# EAGLE design SN74ALVC164245 Level Shifter (EAGLE 9.5.2)
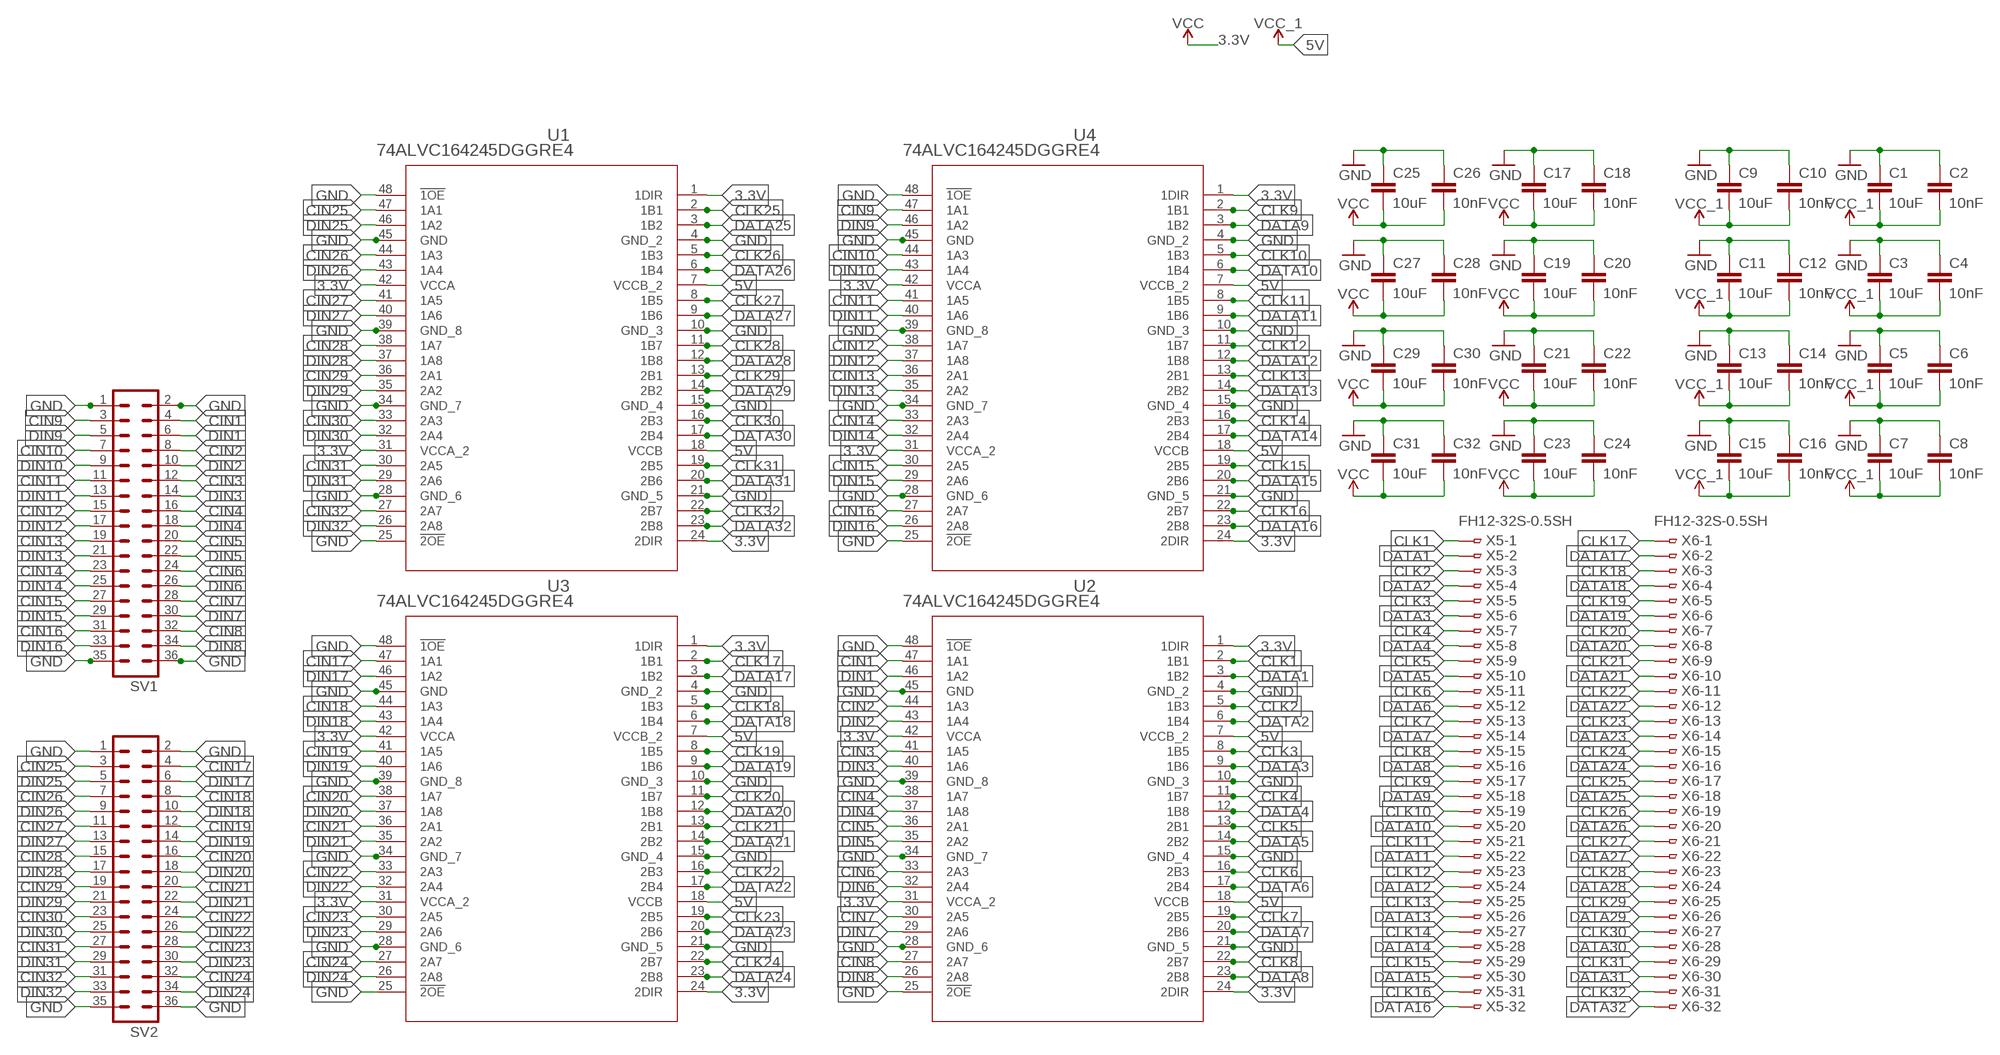
[diagram p0: schematic, sheet 1]

## Parts
C1  10uF  10UF-0402T-6.3V-20%  [0402-TIGHT]
C2  10nF  10NF-0402T-25V-10%  [0402-TIGHT]
C3  10uF  10UF-0402T-6.3V-20%  [0402-TIGHT]
C4  10nF  10NF-0402T-25V-10%  [0402-TIGHT]
C5  10uF  10UF-0402T-6.3V-20%  [0402-TIGHT]
C6  10nF  10NF-0402T-25V-10%  [0402-TIGHT]
C7  10uF  10UF-0402T-6.3V-20%  [0402-TIGHT]
C8  10nF  10NF-0402T-25V-10%  [0402-TIGHT]
C9  10uF  10UF-0402T-6.3V-20%  [0402-TIGHT]
C10  10nF  10NF-0402T-25V-10%  [0402-TIGHT]
C11  10uF  10UF-0402T-6.3V-20%  [0402-TIGHT]
C12  10nF  10NF-0402T-25V-10%  [0402-TIGHT]
C13  10uF  10UF-0402T-6.3V-20%  [0402-TIGHT]
C14  10nF  10NF-0402T-25V-10%  [0402-TIGHT]
C15  10uF  10UF-0402T-6.3V-20%  [0402-TIGHT]
C16  10nF  10NF-0402T-25V-10%  [0402-TIGHT]
C17  10uF  10UF-0402T-6.3V-20%  [0402-TIGHT]
C18  10nF  10NF-0402T-25V-10%  [0402-TIGHT]
C19  10uF  10UF-0402T-6.3V-20%  [0402-TIGHT]
C20  10nF  10NF-0402T-25V-10%  [0402-TIGHT]
C21  10uF  10UF-0402T-6.3V-20%  [0402-TIGHT]
C22  10nF  10NF-0402T-25V-10%  [0402-TIGHT]
C23  10uF  10UF-0402T-6.3V-20%  [0402-TIGHT]
C24  10nF  10NF-0402T-25V-10%  [0402-TIGHT]
C25  10uF  10UF-0402T-6.3V-20%  [0402-TIGHT]
C26  10nF  10NF-0402T-25V-10%  [0402-TIGHT]
C27  10uF  10UF-0402T-6.3V-20%  [0402-TIGHT]
C28  10nF  10NF-0402T-25V-10%  [0402-TIGHT]
C29  10uF  10UF-0402T-6.3V-20%  [0402-TIGHT]
C30  10nF  10NF-0402T-25V-10%  [0402-TIGHT]
C31  10uF  10UF-0402T-6.3V-20%  [0402-TIGHT]
C32  10nF  10NF-0402T-25V-10%  [0402-TIGHT]
SV1  MA18-2  [MA18-2]
SV2  MA18-2  [MA18-2]
U1  74ALVC164245DGGRE4  [DGG48]
U2  74ALVC164245DGGRE4  [DGG48]
U3  74ALVC164245DGGRE4  [DGG48]
U4  74ALVC164245DGGRE4  [DGG48]
X5  FH12-32S-0.5SH  [FH12-32S-0.5SH]
X6  FH12-32S-0.5SH  [FH12-32S-0.5SH]

## Nets
3.3V: C17.2 C18.2 C19.2 C20.2 C21.2 C22.2 C23.2 C24.2 C25.2 C26.2 C27.2 C28.2 C29.2 C30.2 C31.2 C32.2 U1.1(1DIR) U1.24(2DIR) U1.31(VCCA_2) U1.42(VCCA) U2.1(1DIR) U2.24(2DIR) U2.31(VCCA_2) U2.42(VCCA) U3.1(1DIR) U3.24(2DIR) U3.31(VCCA_2) U3.42(VCCA) U4.1(1DIR) U4.24(2DIR) U4.31(VCCA_2) U4.42(VCCA) ; supply symbol labelled VCC
5V: C1.2 C2.2 C3.2 C4.2 C5.2 C6.2 C7.2 C8.2 C9.2 C10.2 C11.2 C12.2 C13.2 C14.2 C15.2 C16.2 U1.7(VCCB_2) U1.18(VCCB) U2.7(VCCB_2) U2.18(VCCB) U3.7(VCCB_2) U3.18(VCCB) U4.7(VCCB_2) U4.18(VCCB) ; supply symbol labelled VCC_1
CIN1: SV1.4 U2.47(1A1)
CIN2: SV1.8 U2.44(1A3)
CIN3: SV1.12 U2.41(1A5)
CIN4: SV1.16 U2.38(1A7)
CIN5: SV1.20 U2.36(2A1)
CIN6: SV1.24 U2.33(2A3)
CIN7: SV1.28 U2.30(2A5)
CIN8: SV1.32 U2.27(2A7)
CIN9: SV1.3 U4.47(1A1)
CIN10: SV1.7 U4.44(1A3)
CIN11: SV1.11 U4.41(1A5)
CIN12: SV1.15 U4.38(1A7)
CIN13: SV1.19 U4.36(2A1)
CIN14: SV1.23 U4.33(2A3)
CIN15: SV1.27 U4.30(2A5)
CIN16: SV1.31 U4.27(2A7)
CIN17: SV2.4 U3.47(1A1)
CIN18: SV2.8 U3.44(1A3)
CIN19: SV2.12 U3.41(1A5)
CIN20: SV2.16 U3.38(1A7)
CIN21: SV2.20 U3.36(2A1)
CIN22: SV2.24 U3.33(2A3)
CIN23: SV2.28 U3.30(2A5)
CIN24: SV2.32 U3.27(2A7)
CIN25: SV2.3 U1.47(1A1)
CIN26: SV2.7 U1.44(1A3)
CIN27: SV2.11 U1.41(1A5)
CIN28: SV2.15 U1.38(1A7)
CIN29: SV2.19 U1.36(2A1)
CIN30: SV2.23 U1.33(2A3)
CIN31: SV2.27 U1.30(2A5)
CIN32: SV2.31 U1.27(2A7)
CLK1: U2.2(1B1) X5.1
CLK2: U2.5(1B3) X5.3
CLK3: U2.8(1B5) X5.5
CLK4: U2.11(1B7) X5.7
CLK5: U2.13(2B1) X5.9
CLK6: U2.16(2B3) X5.11
CLK7: U2.19(2B5) X5.13
CLK8: U2.22(2B7) X5.15
CLK9: U4.2(1B1) X5.17
CLK10: U4.5(1B3) X5.19
CLK11: U4.8(1B5) X5.21
CLK12: U4.11(1B7) X5.23
CLK13: U4.13(2B1) X5.25
CLK14: U4.16(2B3) X5.27
CLK15: U4.19(2B5) X5.29
CLK16: U4.22(2B7) X5.31
CLK17: U3.2(1B1) X6.1
CLK18: U3.5(1B3) X6.3
CLK19: U3.8(1B5) X6.5
CLK20: U3.11(1B7) X6.7
CLK21: U3.13(2B1) X6.9
CLK22: U3.16(2B3) X6.11
CLK23: U3.19(2B5) X6.13
CLK24: U3.22(2B7) X6.15
CLK25: U1.2(1B1) X6.17
CLK26: U1.5(1B3) X6.19
CLK27: U1.8(1B5) X6.21
CLK28: U1.11(1B7) X6.23
CLK29: U1.13(2B1) X6.25
CLK30: U1.16(2B3) X6.27
CLK31: U1.19(2B5) X6.29
CLK32: U1.22(2B7) X6.31
DATA1: U2.3(1B2) X5.2
DATA2: U2.6(1B4) X5.4
DATA3: U2.9(1B6) X5.6
DATA4: U2.12(1B8) X5.8
DATA5: U2.14(2B2) X5.10
DATA6: U2.17(2B4) X5.12
DATA7: U2.20(2B6) X5.14
DATA8: U2.23(2B8) X5.16
DATA9: U4.3(1B2) X5.18
DATA10: U4.6(1B4) X5.20
DATA11: U4.9(1B6) X5.22
DATA12: U4.12(1B8) X5.24
DATA13: U4.14(2B2) X5.26
DATA14: U4.17(2B4) X5.28
DATA15: U4.20(2B6) X5.30
DATA16: U4.23(2B8) X5.32
DATA17: U3.3(1B2) X6.2
DATA18: U3.6(1B4) X6.4
DATA19: U3.9(1B6) X6.6
DATA20: U3.12(1B8) X6.8
DATA21: U3.14(2B2) X6.10
DATA22: U3.17(2B4) X6.12
DATA23: U3.20(2B6) X6.14
DATA24: U3.23(2B8) X6.16
DATA25: U1.3(1B2) X6.18
DATA26: U1.6(1B4) X6.20
DATA27: U1.9(1B6) X6.22
DATA28: U1.12(1B8) X6.24
DATA29: U1.14(2B2) X6.26
DATA30: U1.17(2B4) X6.28
DATA31: U1.20(2B6) X6.30
DATA32: U1.23(2B8) X6.32
DIN1: SV1.6 U2.46(1A2)
DIN2: SV1.10 U2.43(1A4)
DIN3: SV1.14 U2.40(1A6)
DIN4: SV1.18 U2.37(1A8)
DIN5: SV1.22 U2.35(2A2)
DIN6: SV1.26 U2.32(2A4)
DIN7: SV1.30 U2.29(2A6)
DIN8: SV1.34 U2.26(2A8)
DIN9: SV1.5 U4.46(1A2)
DIN10: SV1.9 U4.43(1A4)
DIN11: SV1.13 U4.40(1A6)
DIN12: SV1.17 U4.37(1A8)
DIN13: SV1.21 U4.35(2A2)
DIN14: SV1.25 U4.32(2A4)
DIN15: SV1.29 U4.29(2A6)
DIN16: SV1.33 U4.26(2A8)
DIN17: SV2.6 U3.46(1A2)
DIN18: SV2.10 U3.43(1A4)
DIN19: SV2.14 U3.40(1A6)
DIN20: SV2.18 U3.37(1A8)
DIN21: SV2.22 U3.35(2A2)
DIN22: SV2.26 U3.32(2A4)
DIN23: SV2.30 U3.29(2A6)
DIN24: SV2.34 U3.26(2A8)
DIN25: SV2.5 U1.46(1A2)
DIN26: SV2.9 U1.43(1A4)
DIN27: SV2.13 U1.40(1A6)
DIN28: SV2.17 U1.37(1A8)
DIN29: SV2.21 U1.35(2A2)
DIN30: SV2.25 U1.32(2A4)
DIN31: SV2.29 U1.29(2A6)
DIN32: SV2.33 U1.26(2A8)
GND: C1.1 C2.1 C3.1 C4.1 C5.1 C6.1 C7.1 C8.1 C9.1 C10.1 C11.1 C12.1 C13.1 C14.1 C15.1 C16.1 C17.1 C18.1 C19.1 C20.1 C21.1 C22.1 C23.1 C24.1 C25.1 C26.1 C27.1 C28.1 C29.1 C30.1 C31.1 C32.1 SV1.1 SV1.2 SV1.35 SV1.36 SV2.1 SV2.2 SV2.35 SV2.36 U1.4(GND_2) U1.10(GND_3) U1.15(GND_4) U1.21(GND_5) U1.25(!2OE) U1.28(GND_6) U1.34(GND_7) U1.39(GND_8) U1.45(GND) U1.48(!1OE) U2.4(GND_2) U2.10(GND_3) U2.15(GND_4) U2.21(GND_5) U2.25(!2OE) U2.28(GND_6) U2.34(GND_7) U2.39(GND_8) U2.45(GND) U2.48(!1OE) U3.4(GND_2) U3.10(GND_3) U3.15(GND_4) U3.21(GND_5) U3.25(!2OE) U3.28(GND_6) U3.34(GND_7) U3.39(GND_8) U3.45(GND) U3.48(!1OE) U4.4(GND_2) U4.10(GND_3) U4.15(GND_4) U4.21(GND_5) U4.25(!2OE) U4.28(GND_6) U4.34(GND_7) U4.39(GND_8) U4.45(GND) U4.48(!1OE)

## Library data of the parts
C1 C3 C5 C7 C9 C11 C13 C15 C17 C19 C21 C23 C25 C27 C29 C31 = SparkFun-Capacitors:10UF: 10.0µF ceramic capacitors A capacitor is a passive two-terminal electrical component used to store electrical energy temporarily in an electric field.; PROD_ID: CAP-14848
C2 C4 C6 C8 C10 C12 C14 C16 C18 C20 C22 C24 C26 C28 C30 C32 = SparkFun-Capacitors:10NF: 0.01uF/10nF/10,000pF ceramic capacitors A capacitor is a passive two-terminal electrical component used to store electrical energy temporarily in an electric field. CAP-09321; PROD_ID: CAP-14847
SV1 SV2 = con-lstb:MA18-2: PIN HEADER; OC_FARNELL: unknown; OC_NEWARK: unknown
U1-U4 = SN74ALVC164245:74ALVC164245DGGRE4; DATASHEET_URL: http://www.ti.com/lit/gpn/SN74ALVC164245; DESCRIPTION: 16-Bit 2.5-V to 3.3-V/3.3-V To 5-V Level Shifting Transceiver With 3-State Outputs; FAMILY_NAME: DIRECTION CONTROL DUAL SUPPLY TRANSLATOR; GENERIC_PART_NUMBER: SN74ALVC164245; INDUSTRY_STD_PKG_TYPE: TSSOP; MANUFACTURER: Texas Instruments; MANUFACTURER_PART_NUMBER: 74ALVC164245DGGRE4; PACKAGE_DESIGNATOR: DGG; PIN_COUNT: 48; VENDOR: Texas Instruments
X5 X6 = con-hirose:FH12-32S-0.5S: 0.5mm Pitch Connectors For FPC/FFC Source: Data sheet <http://www.hirose.co.jp/cataloge_hp/e58605370.pdf>; OC_FARNELL: unknown; OC_NEWARK: unknown

## Board
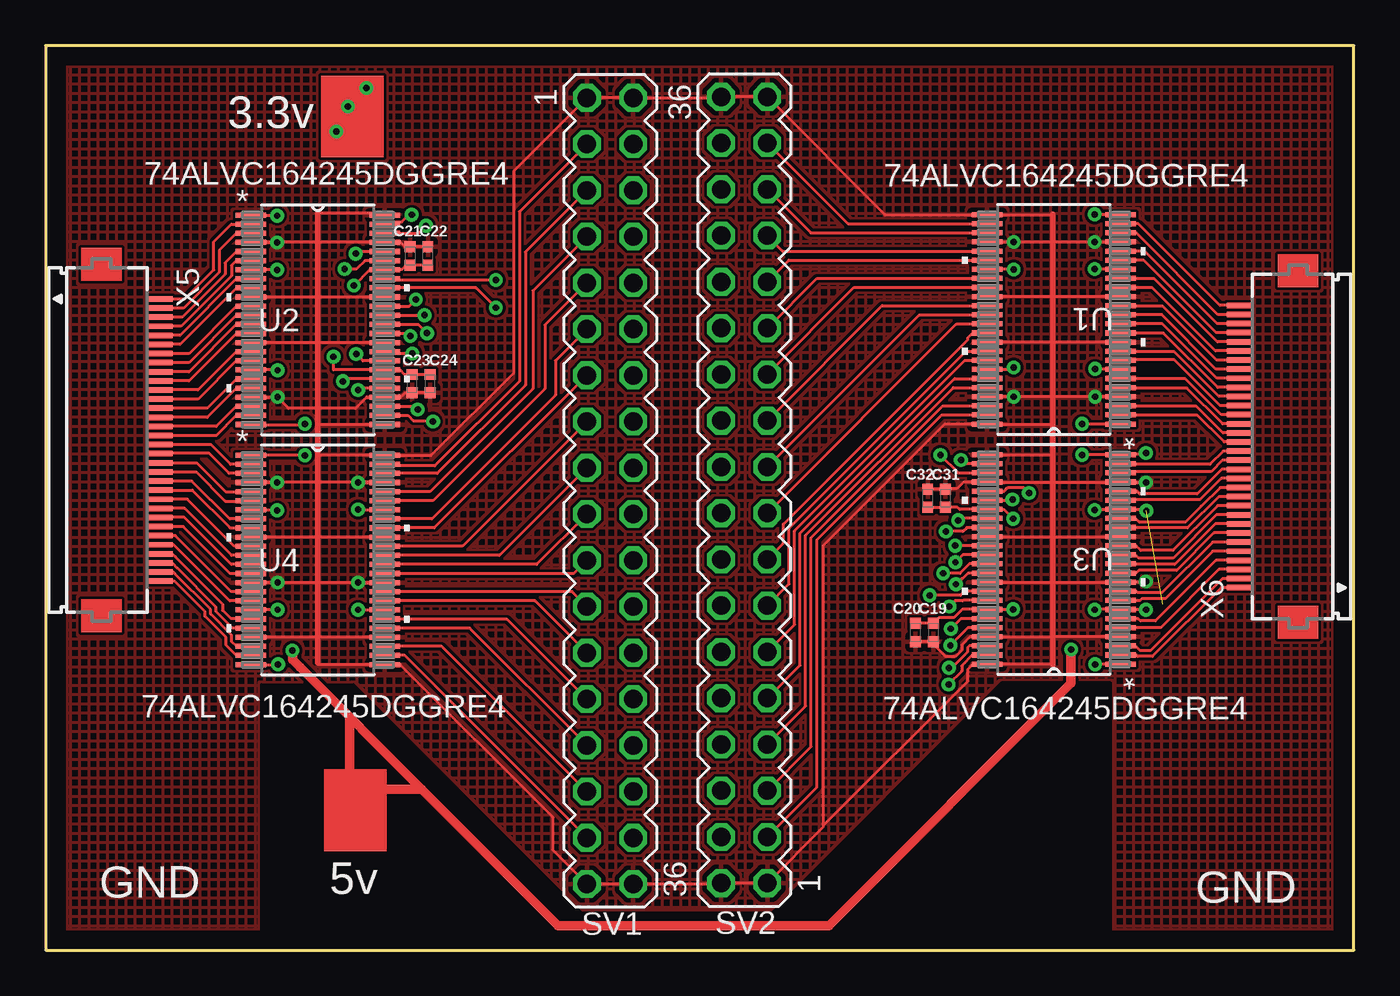
[diagram p1: board, top side]
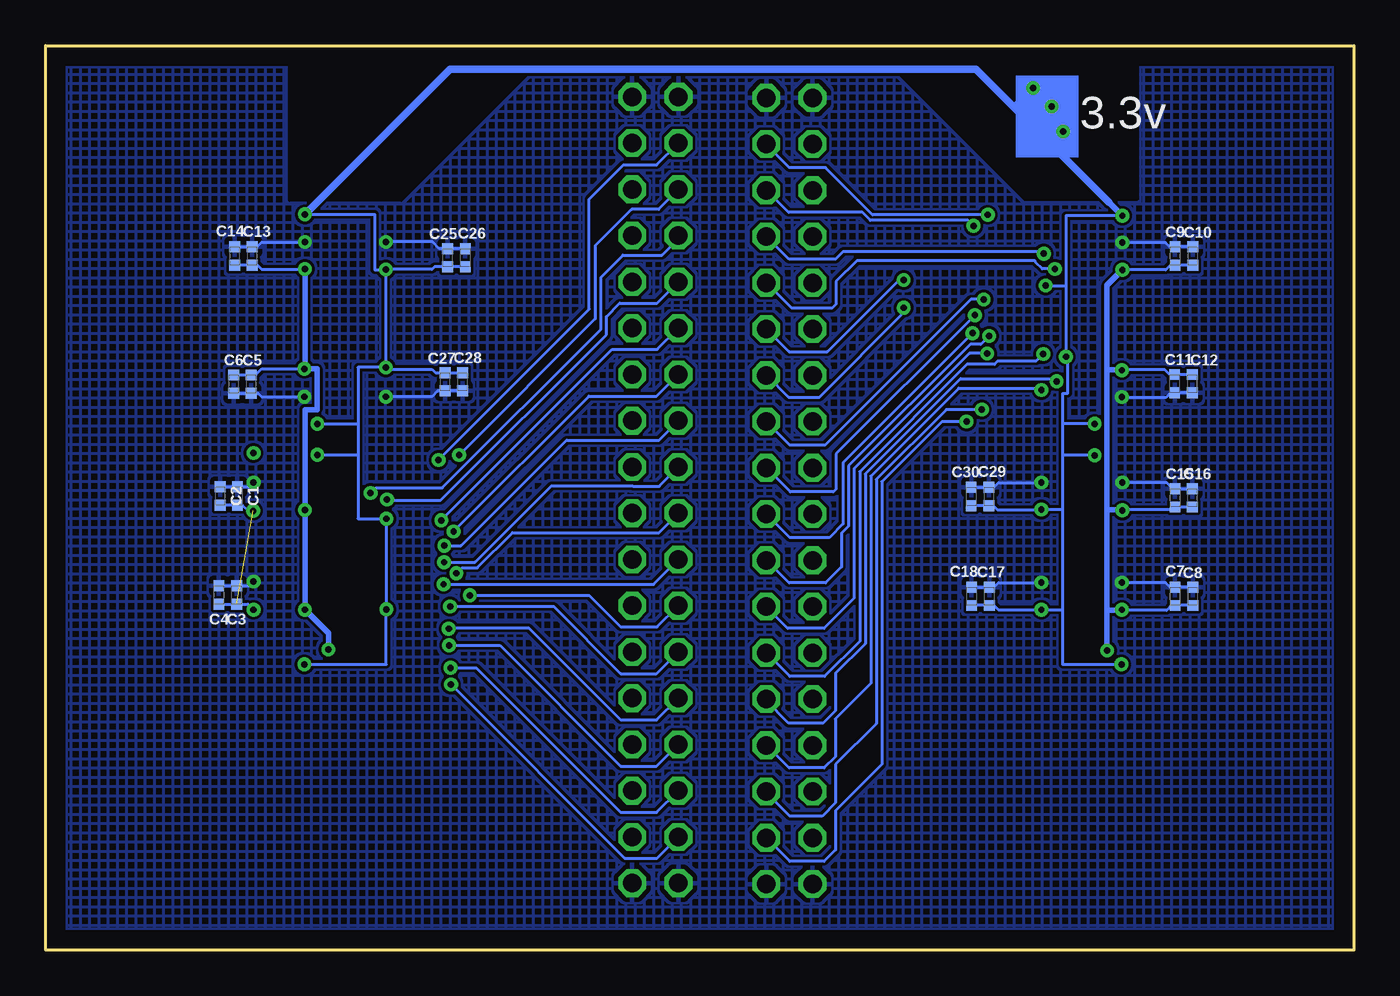
[diagram p2: board, bottom side, seen from below]

Size 71.88 x 49.68 mm. Coordinates in mm from the lower left corner, seen from the top.
Outline: 0,0 71.88,0 71.88,49.68 0,49.68 0,0
Copper layers (1*16): Top 0.035mm / dielectric 1.5mm / Bottom 0.035mm
Design rules "default": minimum track width 6mil, minimum drill 0.35mm, track to track 6mil, track to pad 6mil, pad to pad 6mil, via to via 6mil, smd to smd 6mil, copper to edge 40mil, drill to drill 6mil, minimum pad ring 10mil, minimum via ring 8mil, stop-mask expansion 4mil, vias tented up to drill 0mil, thermal gap 10mil

### Footprints (pad centres in the part's own frame; a part is rotated, then mirrored left to right if it is on the bottom)
0402-TIGHT = smd 0.6 x 0.6: 1 -0.5,0; 2 0.5,0
MA18-2 = drill 1.016 octagon: 1 -21.59,-1.27; 2 -21.59,1.27; 3 -19.05,-1.27; 4 -19.05,1.27; 5 -16.51,-1.27; 6 -16.51,1.27; 7 -13.97,-1.27; 8 -13.97,1.27; 9 -11.43,-1.27; 10 -11.43,1.27; 11 -8.89,-1.27; 12 -8.89,1.27; 13 -6.35,-1.27; 14 -6.35,1.27; 15 -3.81,-1.27; 16 -3.81,1.27; 17 -1.27,-1.27; 18 -1.27,1.27; 19 1.27,-1.27; 20 1.27,1.27; 21 3.81,-1.27; 22 3.81,1.27; 23 6.35,-1.27; 24 6.35,1.27; 25 8.89,-1.27; 26 8.89,1.27; 27 11.43,-1.27; 28 11.43,1.27; 29 13.97,-1.27; 30 13.97,1.27; 31 16.51,-1.27; 32 16.51,1.27; 33 19.05,-1.27; 34 19.05,1.27; 35 21.59,-1.27; 36 21.59,1.27
DGG48 = smd 1.676 x 0.279: 1 -3.67,5.75; 2 -3.67,5.25; 3 -3.67,4.75; 4 -3.67,4.25; 5 -3.67,3.75; 6 -3.67,3.25; 7 -3.67,2.75; 8 -3.67,2.25; 9 -3.67,1.75; 10 -3.67,1.25; 11 -3.67,0.75; 12 -3.67,0.25; 13 -3.67,-0.25; 14 -3.67,-0.75; 15 -3.67,-1.25; 16 -3.67,-1.75; 17 -3.67,-2.25; 18 -3.67,-2.75; 19 -3.67,-3.25; 20 -3.67,-3.75; 21 -3.67,-4.25; 22 -3.67,-4.75; 23 -3.67,-5.25; 24 -3.67,-5.75; 25 3.67,-5.75; 26 3.67,-5.25; 27 3.67,-4.75; 28 3.67,-4.25; 29 3.67,-3.75; 30 3.67,-3.25; 31 3.67,-2.75; 32 3.67,-2.25; 33 3.67,-1.75; 34 3.67,-1.25; 35 3.67,-0.75; 36 3.67,-0.25; 37 3.67,0.25; 38 3.67,0.75; 39 3.67,1.25; 40 3.67,1.75; 41 3.67,2.25; 42 3.67,2.75; 43 3.67,3.25; 44 3.67,3.75; 45 3.67,4.25; 46 3.67,4.75; 47 3.67,5.25; 48 3.67,5.75
FH12-32S-0.5SH = smd 0.3 x 1.3: 1 -7.75,3.25; 2 -7.25,3.25; 3 -6.75,3.25; 4 -6.25,3.25; 5 -5.75,3.25; 6 -5.25,3.25; 7 -4.75,3.25; 8 -4.25,3.25; 9 -3.75,3.25; 10 -3.25,3.25; 11 -2.75,3.25; 12 -2.25,3.25; 13 -1.75,3.25; 14 -1.25,3.25; 15 -0.75,3.25; 16 -0.25,3.25; 17 0.25,3.25; 18 0.75,3.25; 19 1.25,3.25; 20 1.75,3.25; 21 2.25,3.25; 22 2.75,3.25; 23 3.25,3.25; 24 3.75,3.25; 25 4.25,3.25; 26 4.75,3.25; 27 5.25,3.25; 28 5.75,3.25; 29 6.25,3.25; 30 6.75,3.25; 31 7.25,3.25; 32 7.75,3.25

### Placement (x,y rotation side)
C1  61.34,24.94 270 bottom
C2  62.28,24.94 270 bottom
C3  61.39,19.51 270 bottom
C4  62.36,19.51 270 bottom
C5  60.58,31.09 90 bottom
C6  61.54,31.09 90 bottom
C7  9.83,19.43 270 bottom
C8  8.86,19.43 270 bottom
C9  9.83,38.13 270 bottom
C10  8.86,38.13 270 bottom
C11  9.86,31.12 90 bottom
C12  8.89,31.12 90 bottom
C13  60.53,38.13 270 bottom
C14  61.49,38.13 270 bottom
C15  9.83,24.84 270 bottom
C16  8.89,24.84 270 bottom
C17  20.04,19.43 270 bottom
C18  21.01,19.43 270 bottom
C19  48.77,17.45 90 top
C20  47.78,17.45 90 top
C21  20.04,38.13 270 top
C22  21.01,38.13 270 top
C23  20.14,31.12 90 top
C24  21.13,31.12 90 top
C25  49.78,38.02 270 bottom
C26  48.82,38.02 270 bottom
C27  49.94,31.22 90 bottom
C28  48.97,31.22 90 bottom
C29  20.07,24.92 270 bottom
C30  21.03,24.92 270 bottom
C31  49.43,24.82 270 top
C32  48.46,24.82 270 top
SV1  31.01,25.22 270 top
SV2  38.38,25.27 90 top
U1  55.4,34.65 180 top
U2  14.96,34.62 0 top
U3  55.4,21.46 180 top
U4  14.96,21.44 0 top
X5  3.07,28.02 270 top
X6  68.81,27.66 90 top

### Tracks (layer width: path | path; a pad name or v marks a point on that pad's centre or on a via)
3.3V  (via drill 0.35)
  Top 0.152: v60.45,27.31 60.38,27.23 59.08,27.23 U3.24 v56.95,27.21 v56.95,27.2 | C32.2 C31.2 50.11,24.32 50.21,24.21 U3.31 52.65,24.21 v53.16,23.7 | C20.2 C19.2 49.08,18.26 49.91,18.26 50.36,18.71 U3.42 v53.16,18.71 v53.16,18.72 | C24.2 C23.2 19.72,31.62 19.47,31.87 U2.31 15.82,31.87 v15.82,32.59 | U1.42 53.19,31.9 v53.19,32 | v53.19,37.39 53.18,37.4 U1.31 | v17.17,24.21 17.27,24.21 17.3,24.18 U4.42 | v17.17,18.69 U4.31 | C22.2 C21.2 19.82,37.63 19.56,37.37 U2.42 17.81,37.37 v16.94,36.5 | U4.24 v12.78,15.69 v12.78,15.7 | U2.1 12.73,40.37 v12.73,40.34 | U2.24 14.25,28.87 v14.25,28.91 | v14.25,27.18 14.24,27.19 U4.1 | U1.1 v56.95,28.9 v56.95,28.91 | U1.24 57.63,40.4 v57.63,40.41 | U3.1 57.66,15.71 v57.66,15.7 | v17.63,47.35 17.83,47.14 | v16.61,46.33 16.97,46.05 | v15.98,44.96 16.23,44.65
  Bottom 0.152: v53.19,32 53.09,31.9 50.65,31.9 50.46,31.72 C27.2 C28.2 | C26.2 C25.2 50.51,37.52 50.65,37.39 53.06,37.39 | 53.06,37.39 v53.19,37.39 v53.19,32 | C30.2 C29.2 19.82,24.42 19.58,24.18 17.2,24.18 v17.17,24.21 16,24.21 | C18.2 C17.2 19.77,18.93 19.53,18.69 v17.17,18.69 16,18.69 | 16,18.69 16,24.21 | v16.94,36.5 15.82,36.5 | 15.82,36.5 v15.82,32.59 15.72,32.59 15.72,30.58 16,30.58 16,28.91 | 16,24.21 16,27.18 | 16,27.18 16,28.91 | v12.78,15.7 16,15.7 16,18.69 | v12.73,40.34 15.82,40.34 15.82,36.5 | v14.25,28.91 16,28.91 | v14.25,27.18 16,27.18 | v53.19,32 54.71,32 54.71,28.91 | 54.71,28.91 54.71,27.2 | 54.71,27.2 54.71,23.7 v53.16,23.7 v53.16,18.72 53.16,15.7 v57.66,15.7 | v56.95,28.91 54.71,28.91 | v57.63,40.41 53.8,40.41 53.8,37.36 53.06,37.36 53.06,37.39 | v56.95,27.2 54.71,27.2 | 18.76,46.37 v17.63,47.35 | 17.87,45.48 v16.61,46.33 | 16.65,44.26 v15.98,44.96
  Bottom 0.305: v12.73,40.34 13.46,41.07
  Bottom 0.406: 13.46,41.07 16.65,44.26 17.87,45.48 18.76,46.37 20.78,48.39 49.66,48.39 v57.63,40.41
  cutout Bottom (isolate 0.004): 11.91,41.22 18.08,41.22 18.52,41.66 24.97,48.11 29.21,48.11 45.39,48.11 52.32,41.17 58.47,41.17 58.47,49.48 13.13,49.48 11.91,49.48
5V  (via drill 0.35)  (1 unrouted)
  Top 0.152: v60.48,24.13 60.48,24.21 U3.18 57.63,24.21 v57.63,24.18 | v60.45,18.69 60.43,18.71 U3.7 57.63,18.71 v57.63,18.69 | v57.66,31.93 59.04,31.93 U1.7 | v57.63,37.41 59.05,37.41 U1.18 | v12.73,24.16 11.32,24.16 U4.7 | v12.75,18.69 U4.18 | U2.18 12.73,31.88 v12.75,31.85 | v12.73,37.36 U2.7
  Top 0.305: 13.98,15.53 16.69,12.83 | 20.66,8.85 28.24,1.27 42.95,1.27 56.34,14.66 56.34,14.81
  Top 0.508: 20.66,8.85 13.98,15.53 13.56,15.95 v13.56,16.46 | 20.66,8.85 28.17,1.35 43.03,1.35 56.34,14.66 | 56.34,14.81 v56.34,16.51 | 16.69,12.83 16.71,12.8 16.71,8.89 16.75,8.85 20.66,8.85
  Bottom 0.152: v60.48,24.13 60.5,24.16 60.78,24.16 61.07,24.44 C1.2 C2.2 | C4.2 C3.2 60.76,19.01 v60.45,18.69 | C6.2 60.63,31.59 60.6,31.62 C5.2 60.33,31.59 59.99,31.93 v57.66,31.93 57.66,37.39 | 57.66,37.39 59.99,37.39 60.23,37.63 C13.2 C14.2 | 57.66,37.39 v57.63,37.41 | 12.7,24.18 v12.73,24.16 | 12.7,24.18 12.62,24.18 9.99,24.18 C15.2 C16.2 | C8.2 C7.2 10.02,18.93 10.29,18.67 12.73,18.67 v12.75,18.69 13.56,18.69 | C12.2 C11.2 10.13,31.62 10.39,31.88 12.73,31.88 v12.75,31.85 | C10.2 C9.2 10.08,37.63 10.34,37.36 v12.73,37.36 | 13.56,24.18 12.7,24.18
  Bottom 0.305: v56.34,16.51 56.34,17.4 v57.63,18.69 57.63,29.69 56.97,29.69 56.97,31.93 v57.66,31.93 57.63,31.95 v57.63,37.41 | v13.56,16.46 13.56,18.69 | 13.56,18.69 13.54,18.67 12.73,18.67 | 13.56,18.69 13.56,24.18 | 13.56,24.18 12.62,24.18 | 13.56,24.18 13.56,31.88 | 12.73,31.88 13.56,31.88 | 13.56,31.88 13.56,36.53 v12.73,37.36
  cutout Top (isolate 0.004): 11.86,14.58 16.92,14.58 29.44,2.06 39.9,2.06 52.55,14.71 58.5,14.71 58.5,0.58 11.86,0.58
5V1
  Bottom 1.27: 17.18,45.72 17.2,45.72
CIN1  (via drill 0.35)
  Top 0.152: U2.47 18.76,40 19.56,40 19.95,40.39 v20.12,40.39
  Bottom 0.152: v20.12,40.39 26.44,40.39 29.03,42.98 31.01,42.98 32.28,44.25 SV1.4
CIN2  (via drill 0.35)
  Top 0.152: U2.44 17.16,38.37 v17.04,38.25
  Bottom 0.152: v17.04,38.25 17.17,38.38 28.04,38.38 28.47,37.95 31.04,37.95 SV1.8
CIN3  (via drill 0.35)
  Top 0.152: v24.74,36.8 18.7,36.8 U2.41
  Bottom 0.152: SV1.12 31.04,32.87 28.93,32.87 24.99,36.8 v24.74,36.8
CIN4  (via drill 0.35)
  Top 0.152: U2.38 19.98,35.37 v20.35,35.74
  Bottom 0.152: v20.35,35.74 21.06,35.74 29.06,27.74 30.99,27.74 SV1.16
CIN5  (via drill 0.35)
  Top 0.152: U2.36 20.47,34.37 v20.96,33.89
  Bottom 0.152: v20.96,33.89 28.07,26.78 28.07,23.42 28.83,22.66 30.99,22.66 SV1.20
CIN6  (via drill 0.35)
  Top 0.152: U2.33 18.73,32.77 v20.15,32.77
  Bottom 0.152: v20.15,32.77 21.13,32.77 27.46,26.44 27.46,19.33 29.11,17.68 31.11,17.68 32.28,18.85 SV1.24
CIN7  (via drill 0.35)
  Top 0.152: U2.30 18.61,31.4 16.49,31.4 v16.33,31.24
  Bottom 0.152: v16.33,31.24 16.48,31.39 21.62,31.39 26.85,26.16 26.85,16.84 28.47,15.22 28.47,13.16 29.16,12.47 31.06,12.47 32.28,13.69 SV1.28
CIN8  (via drill 0.35)
  Top 0.152: U2.27 20.27,29.87 v20.45,29.69
  Bottom 0.152: v20.45,29.69 22.4,29.69 26.24,25.86 26.24,12.45 28.47,10.21 28.47,8.1 29.21,7.37 30.99,7.37 32.28,8.66 SV1.32
CIN9
  Top 0.152: SV1.3 26.03,40.56 26.03,31.24 21.39,26.59 18.72,26.59 U4.47
CIN10
  Top 0.152: SV1.7 26.77,36.22 26.77,30.84 21.12,25.19 U4.44
CIN11
  Top 0.152: SV1.11 28.02,32.39 28.02,30.48 21.22,23.69 U4.41
CIN12
  Top 0.152: SV1.15 22.9,22.19 U4.38
CIN13
  Top 0.152: SV1.19 26.98,21.19 U4.36
CIN14
  Top 0.152: SV1.23 28.93,19.69 U4.33
CIN15
  Top 0.152: SV1.27 25.35,18.19 U4.30
CIN16
  Top 0.152: SV1.31 21.77,16.69 U4.27
CIN17  (via drill 0.35)
  Top 0.152: v49.61,14.6 50.33,15.32 50.33,15.62 50.93,16.21 U3.47
  Bottom 0.152: v49.61,14.6 40.06,5.05 38.28,5.05 SV2.4
CIN18  (via drill 0.35)
  Top 0.152: U3.44 50.68,17.71 v49.71,16.74
  Bottom 0.152: v49.71,16.74 46.92,16.74 40.28,10.11 38.3,10.11 SV2.8
CIN19  (via drill 0.35)
  Top 0.152: U3.41 50.42,19.21 50.39,19.18 49.96,19.18 v49.65,18.88
  Bottom 0.152: v49.65,18.88 43.97,18.88 40.28,15.19 38.3,15.19 SV2.12
CIN20  (via drill 0.35)
  Top 0.152: U3.38 50.68,20.71 50.36,20.4 50.31,20.4 v50.01,20.1
  Bottom 0.152: v50.01,20.1 38.48,20.1 SV2.16
CIN21  (via drill 0.35)
  Top 0.152: U3.36 50.39,21.71 v49.99,21.31
  Bottom 0.152: v49.99,21.31 48.29,21.31 44.09,25.5 39.62,25.5 39.6,25.48 38.18,25.48 SV2.20
CIN22  (via drill 0.35)
  Top 0.152: U3.33 50.6,23.21 50.39,23 v49.47,23 v49.46,23
  Bottom 0.152: v49.46,23 42.03,30.43 38.3,30.43 SV2.24
CIN23  (via drill 0.35)
  Top 0.152: U3.30 53.08,24.71 v53.12,24.76
  Bottom 0.152: v53.12,24.76 53.08,24.71 50.16,24.71 41.07,33.81 41.07,34.8 40.34,35.53 38.28,35.53 SV2.28
CIN24  (via drill 0.35)
  Top 0.152: v49.16,27.19 50.14,26.21 U3.27
  Bottom 0.152: SV2.32 38.2,40.69 39.68,40.69 41.68,38.69 41.68,34.68 v49.16,27.19
CIN25
  Top 0.152: SV2.3 42.37,8.94 42.37,22.53 49.23,29.4 U1.47
CIN26
  Top 0.152: SV2.7 41.76,13.41 41.76,22.78 49.87,30.9 U1.44
CIN27
  Top 0.152: SV2.11 41.15,17.88 41.15,23.04 50.5,32.39 U1.41
CIN28
  Top 0.152: SV2.15 40.54,22.35 40.54,23.39 50.65,33.5 50.65,33.62 50.92,33.89 U1.38
CIN29
  Top 0.152: SV2.19 48,34.9 U1.36
CIN30
  Top 0.152: SV2.23 44.42,36.4 U1.33
CIN31
  Top 0.152: SV2.27 40.84,37.9 U1.30
CIN32
  Top 0.152: SV2.31 42.04,39.4 U1.27
CLK1
  Top 0.152: X5.1 7.65,35.77 9.25,37.36 9.25,38.91 10.2,39.87 U2.2
CLK2
  Top 0.152: U2.5 10.48,38.37 9.87,37.75 9.87,37.12 7.51,34.77 X5.3
CLK3
  Top 0.152: U2.8 10.48,36.87 7.39,33.77 X5.5
CLK4
  Top 0.152: U2.11 10.48,35.37 7.89,32.77 X5.7
CLK5
  Top 0.152: U2.13 10.48,34.37 7.89,31.77 X5.9
CLK6
  Top 0.152: U2.16 10.48,32.87 8.39,30.77 X5.11
CLK7
  Top 0.152: U2.19 10.48,31.37 8.89,29.77 X5.13
CLK8
  Top 0.152: U2.22 10.48,29.87 9.39,28.77 X5.15
CLK9
  Top 0.152: U4.2 10.17,26.69 9.09,27.77 X5.17
CLK10
  Top 0.152: X5.19 8.31,26.77 9.89,25.19 U4.5
CLK11
  Top 0.152: U4.8 10.12,23.69 8.04,25.77 X5.21
CLK12
  Top 0.152: U4.11 10.38,22.19 7.8,24.77 X5.23
CLK13
  Top 0.152: U4.13 10.21,21.19 7.63,23.77 X5.25
CLK14
  Top 0.152: U4.16 10.21,19.69 7.13,22.77 X5.27
CLK15
  Top 0.152: U4.19 11.24,18.24 10.16,18.24 9.73,18.67 9.73,19.01 7.2,21.54 7.13,21.61 6.97,21.77 X5.29
CLK16
  Top 0.152: U4.22 10.49,16.69 10.22,16.95 10.22,17.31 9.07,18.47 9.07,18.72 7.11,20.68 7.1,20.68 7.02,20.77 X5.31
CLK17
  Top 0.152: X6.1 64.59,19.91 60.81,16.14 60.01,16.14 59.93,16.21 U3.2
CLK18
  Top 0.152: X6.3 64.46,20.91 61.27,17.71 U3.5
CLK19
  Top 0.152: X6.5 64.12,21.92 61.52,19.31 60.24,19.31 60.13,19.21 U3.8
CLK20
  Top 0.152: X6.7 64.19,22.92 62.14,20.87 60.06,20.87 59.91,20.71 U3.11
CLK21
  Top 0.152: X6.9 64.32,23.92 61.94,21.54 60.06,21.54 59.88,21.71 U3.13
CLK22
  Top 0.152: X6.11 64.46,24.92 62.73,23.19 59.09,23.19 U3.16
CLK23
  Top 0.152: X6.13 64.59,25.91 63.42,24.74 59.09,24.74 U3.19
CLK24
  Top 0.152: X6.15 64.65,26.91 64.03,26.29 59.14,26.29 U3.22
CLK25
  Top 0.152: X6.17 64.75,27.91 63.27,29.39 U1.2
CLK26
  Top 0.152: X6.19 64.66,28.91 62.7,30.87 59.09,30.87 U1.5
CLK27
  Top 0.152: X6.21 64.53,29.91 62,32.44 59.11,32.44 U1.8
CLK28
  Top 0.152: X6.23 64.39,30.91 61.42,33.88 U1.11
CLK29
  Top 0.152: X6.25 64.3,31.91 61.34,34.87 61.34,34.9 U1.13
CLK30
  Top 0.152: X6.27 64.27,32.91 60.81,36.37 59.09,36.37 U1.16
CLK31
  Top 0.152: X6.29 64.31,33.91 60.33,37.9 U1.19
CLK32
  Top 0.152: X6.31 64.4,34.91 59.92,39.4 U1.22
DATA1
  Top 0.152: U2.3 10.48,39.37 9.55,38.43 9.55,37.24 7.58,35.27 X5.2
DATA2
  Top 0.152: U2.6 10.48,37.87 10.22,37.6 10.22,37.05 7.44,34.27 X5.4
DATA3
  Top 0.152: U2.9 10.48,36.37 7.39,33.27 X5.6
DATA4
  Top 0.152: U2.12 11.27,34.89 10.51,34.89 7.89,32.27 X5.8
DATA5
  Top 0.152: U2.14 10.48,33.87 7.89,31.27 X5.10
DATA6
  Top 0.152: U2.17 10.48,32.37 8.39,30.27 X5.12
DATA7
  Top 0.152: U2.20 10.48,30.87 8.89,29.27 X5.14
DATA8
  Top 0.152: U2.23 10.48,29.37 9.39,28.27 X5.16
DATA9
  Top 0.152: U4.3 10.08,26.19 8.99,27.28 6.34,27.28 X5.18
DATA10
  Top 0.152: X5.20 8.28,26.27 9.88,24.66 11.27,24.66 U4.6
DATA11
  Top 0.152: X5.22 8.06,25.27 10.14,23.19 U4.9
DATA12
  Top 0.152: U4.12 10.21,21.69 7.64,24.27 X5.24
DATA13
  Top 0.152: U4.14 10.15,20.69 7.57,23.27 X5.26
DATA14
  Top 0.152: U4.17 10.12,19.19 7.05,22.27 X5.28
DATA15
  Top 0.152: U4.20 10.28,17.69 9.37,18.59 9.37,18.85 7.23,20.99 6.95,21.27 X5.30
DATA16
  Top 0.152: U4.23 10.48,16.19 9.92,16.75 9.92,17.18 8.76,18.34 8.76,18.6 7.09,20.27 X5.32
DATA17
  Top 0.152: X6.2 64.66,20.41 60.71,16.46 60.13,16.46 59.88,16.71 U3.3
DATA18
  Top 0.152: X6.4 64.3,21.41 60.98,18.09 60.16,18.09 60.03,18.21 U3.6
DATA19
  Top 0.152: X6.6 64.12,22.42 61.34,19.64 60.01,19.64 59.93,19.71 U3.9
DATA20
  Top 0.152: X6.8 64.26,23.42 62.03,21.19 59.09,21.19 U3.12
DATA21
  Top 0.152: X6.10 64.39,24.42 61.94,21.96 60.16,21.96 59.91,22.21 U3.14
DATA22
  Top 0.152: X6.12 64.53,25.41 63.5,24.38 | 63.5,24.38 63.47,24.38 | 63.5,24.38 62.62,23.51 60.08,23.51 59.88,23.71 U3.17
DATA23
  Top 0.152: X6.14 64.61,26.41 63.26,25.06 60.11,25.06 59.96,25.21 U3.20
DATA24
  Top 0.152: X6.16 64.7,27.41 63.97,26.69 59.09,26.69 U3.23
DATA25
  Top 0.152: X6.18 64.68,28.41 63.22,29.87 59.09,29.87 U1.3
DATA26
  Top 0.152: X6.20 64.6,29.41 62.62,31.38 U1.6
DATA27
  Top 0.152: X6.22 64.46,30.41 62,32.87 59.09,32.87 U1.9
DATA28
  Top 0.152: X6.24 64.35,31.41 61.34,34.42 59.09,34.42 U1.12
DATA29
  Top 0.152: X6.26 64.34,32.41 61.38,35.37 59.09,35.37 U1.14
DATA30
  Top 0.152: X6.28 64.38,33.41 60.92,36.87 59.09,36.87 U1.17
DATA31
  Top 0.152: X6.30 64.37,34.41 60.38,38.4 U1.20
DATA32
  Top 0.152: X6.32 64.51,35.41 60.03,39.9 U1.23
DIN1  (via drill 0.35)
  Top 0.152: U2.46 20.5,39.37 v20.9,39.78
  Bottom 0.152: v20.9,39.78 21.21,40.08 26.57,40.08 27,40.51 31.06,40.51 SV1.6
DIN2  (via drill 0.35)
  Top 0.152: U2.43 17.54,37.87 17.09,37.41 v16.43,37.41
  Bottom 0.152: v16.43,37.41 17.12,37.41 17.53,37.82 17.53,37.85 17.54,37.86 27.31,37.86 28.45,36.73 28.45,35.48 28.68,35.26 30.89,35.26 SV1.10
DIN3  (via drill 0.35)
  Top 0.152: v24.74,35.28 23.65,36.37 U2.40
  Bottom 0.152: SV1.14 32.26,31.57 31.06,30.38 29.36,30.38 24.74,35 v24.74,35.28
DIN4  (via drill 0.35)
  Top 0.152: U2.37 v20.82,34.87 v20.83,34.87
  Bottom 0.152: v20.83,34.87 28.45,27.25 28.45,25.32 28.6,25.17 30.96,25.17 SV1.18
DIN5  (via drill 0.35)
  Top 0.152: U2.35 19.91,33.87 v20.05,33.73
  Bottom 0.152: v20.05,33.73 20.51,33.27 21.08,33.27 27.76,26.59 27.76,23.29 28.14,22.91 28.14,21.06 29.03,20.17 31.04,20.17 SV1.22
DIN6  (via drill 0.35)
  Top 0.152: U2.32 17.44,32.37 v17.07,32.74
  Bottom 0.152: v17.07,32.74 17.45,32.36 19.55,32.36 19.75,32.17 21.28,32.17 27.15,26.29 27.15,16.97 29.08,15.04 30.99,15.04 SV1.26
DIN7  (via drill 0.35)
  Top 0.152: U2.29 17.27,30.87 v17.17,30.76
  Bottom 0.152: v17.17,30.76 17.27,30.87 21.71,30.87 26.54,26.04 26.54,14.66 28.5,12.7 28.5,10.62 29.11,10.01 31.04,10.01 SV1.30
DIN8  (via drill 0.35)
  Top 0.152: U2.26 19.91,29.37 20.2,29.09 21.23,29.09 v21.29,29.03
  Bottom 0.152: v21.29,29.03 22.63,29.03 25.93,25.73 25.93,10.21 28.47,7.67 28.47,5.51 29.11,4.88 30.99,4.88 SV1.34
DIN9
  Top 0.152: SV1.5 26.37,38.35 26.37,31.04 21.51,26.19 U4.46
DIN10
  Top 0.152: SV1.9 27.43,34.34 27.43,30.84 21.28,24.69 U4.43
DIN11
  Top 0.152: SV1.13 21.36,23.19 U4.40
DIN12
  Top 0.152: SV1.17 24.94,21.69 U4.37
DIN13
  Top 0.152: SV1.21 29.02,20.69 U4.35
DIN14
  Top 0.152: SV1.25 26.89,19.19 U4.32
DIN15
  Top 0.152: SV1.29 23.31,17.69 U4.29
DIN16
  Top 0.152: SV1.33 19.73,16.19 U4.26
DIN17  (via drill 0.35)
  Top 0.152: v49.63,15.51 49.78,15.51 50.65,16.37 50.65,16.61 50.75,16.71 U3.46
  Bottom 0.152: v49.63,15.51 48.22,15.51 40.28,7.57 38.3,7.57 SV2.6
DIN18  (via drill 0.35)
  Top 0.152: U3.43 50.29,18.21 v49.73,17.65
  Bottom 0.152: v49.73,17.65 49.73,17.7 45.34,17.7 40.28,12.65 38.3,12.65 SV2.10
DIN19  (via drill 0.35)
  Top 0.152: U3.40 50.49,19.71 50.26,19.49 v48.57,19.49
  Bottom 0.152: v48.57,19.49 42.02,19.49 40.28,17.75 38.28,17.75 SV2.14
DIN20  (via drill 0.35)
  Top 0.152: U3.37 50.75,21.21 50.24,20.7 v49.31,20.7
  Bottom 0.152: v49.31,20.7 49.01,21 48.16,21 46.23,22.94 38.18,22.94 SV2.18
DIN21  (via drill 0.35)
  Top 0.152: U3.35 v49.97,22.21 v49.97,22.22
  Bottom 0.152: v49.97,22.22 49.05,22.22 43.26,28.02 38.18,28.02 SV2.22
DIN22  (via drill 0.35)
  Top 0.152: U3.32 50.25,23.71 v50.14,23.61
  Bottom 0.152: v50.14,23.61 40.75,32.99 38.28,32.99 SV2.26
DIN23  (via drill 0.35)
  Top 0.152: v54.03,25.11 53.74,25.39 52.84,25.39 52.67,25.21 U3.29
  Bottom 0.152: v54.03,25.11 53.75,25.39 50.09,25.39 41.38,34.1 41.38,36.96 40.16,38.18 38.02,38.18 37.11,39.09 SV2.30
DIN24  (via drill 0.35)
  Top 0.152: U3.26 50.5,26.71 v50.29,26.92
  Bottom 0.152: v50.29,26.92 42.01,35.2 42.01,41.25 40.13,43.13 38.3,43.13 SV2.34
DIN25
  Top 0.152: SV2.5 42.06,11.18 42.06,22.66 49.3,29.89 U1.46
DIN26
  Top 0.152: SV2.9 41.45,15.65 41.45,22.91 49.94,31.39 U1.43
DIN27
  Top 0.152: SV2.13 40.84,20.12 40.84,23.16 50.57,32.89 U1.40
DIN28
  Top 0.152: SV2.17 50.04,34.4 U1.37
DIN29
  Top 0.152: SV2.21 45.96,35.4 U1.35
DIN30
  Top 0.152: SV2.25 42.38,36.9 U1.32
DIN31
  Top 0.152: SV2.29 40.5,38.4 U1.29
DIN32
  Top 0.152: SV2.33 44.08,39.9 U1.26
GND  (via drill 0.35)
  Top 0.152: 55.35,17.21 U3.45 50.77,17.21 50.33,16.77 50.33,16.48 49.98,16.13 49.45,16.13 48.77,16.82 C19.1 C20.1 | 55.35,17.21 55.35,15.7 | 55.35,15.7 55.35,15.67 | 55.35,15.7 51.73,15.7 U3.48 50.94,15.71 50.67,15.44 50.67,14.78 42.72,6.83 | U3.4 55.35,17.21 | U3.39 U3.10 59.1,20.24 v60.45,20.24 | U3.34 U3.15 | U3.25 55.35,27.21 55.35,27.13 | 55.35,26.47 55.35,17.21 | v60.45,25.68 60.42,25.71 U3.21 U3.28 50.43,25.71 50.06,25.35 49.46,25.35 C31.1 C32.1 | 42.72,6.83 42.72,22.23 49.4,28.91 51.72,28.91 U1.48 55.35,28.9 55.35,28.91 | 42.72,6.83 42.72,6.76 SV2.1 SV2.2 37.06,3.63 SV1.36 SV1.35 27.89,5.49 27.89,7.29 19.49,15.69 U4.25 14.96,15.69 14.96,15.77 | 20.04,38.85 C21.1 | C22.1 C21.1 | C21.1 19.74,38.63 19.5,38.87 U2.45 11.38,38.87 11.38,38.86 | C24.1 C23.1 20.12,30.59 19.74,30.59 19.52,30.37 U2.28 17.64,30.37 17.03,29.76 13.35,29.76 12.74,30.37 U2.21 11.32,30.35 12.72,30.35 v12.75,30.38 | 55.35,40.11 55.35,40.4 U1.25 46.12,40.4 SV2.35 SV2.36 37.06,46.81 SV1.2 SV1.1 25.73,42.8 25.73,31.72 21.18,27.18 21.17,27.19 U4.48 14.96,27.19 14.96,27.25 | U1.21 v57.63,38.89 56.06,38.89 | 56.06,38.89 55.35,38.89 | U1.28 v53.19,38.9 56.06,38.9 56.06,38.89 | U1.15 U1.34 | U1.10 U1.39 | U1.4 v57.66,30.4 v53.19,30.4 U1.45 | v17.17,25.68 U4.45 U4.4 v12.73,25.68 | v17.17,20.19 U4.34 U4.15 v12.75,20.19 | v12.73,38.86 11.38,38.86 | 11.38,38.86 11.3,38.86 U2.4 | 14.96,40.46 18.63,40.46 U2.48 | U4.28 U4.21 | U4.39 U4.10 | U2.25 14.96,28.87 14.96,28.91 | U2.34 U2.15 | U2.39 U2.10
  Top 0.305: 55.35,15.67 55.35,26.47 55.35,27.13 55.35,28.91 55.35,38.89 55.35,40.11 55.35,40.41 | 14.96,40.46 14.96,28.91 14.96,27.25 14.96,15.77
  Bottom 0.152: v60.45,25.68 60.69,25.44 C1.1 C2.1 | v60.45,20.24 60.69,20.01 C3.1 C4.1 | C28.1 C27.1 50.33,30.72 50.66,30.4 v53.19,30.4 | C26.1 C25.1 50.26,38.52 50.63,38.9 v53.19,38.9 | C6.1 60.63,30.59 60.6,30.62 C5.1 60.21,30.59 60.01,30.4 v57.66,30.4 | C14.1 C13.1 60.26,38.63 59.99,38.89 v57.63,38.89 | C30.1 C29.1 19.79,25.42 19.53,25.68 v17.17,25.68 | C18.1 C17.1 19.79,19.93 19.53,20.19 v17.17,20.19 | v12.73,25.68 10.29,25.68 9.95,25.34 C15.1 C16.1 | C8.1 C7.1 10.1,19.93 10.36,20.19 v12.75,20.19 | C12.1 C11.1 10.08,30.62 10.34,30.35 12.73,30.35 v12.75,30.38 | C10.1 C9.1 10.13,38.63 10.36,38.86 v12.73,38.86
  pour Bottom (isolate 0.008, hatched): 0.03,49.68 0.03,0 71.88,0 71.88,49.68
  pour Top (isolate 0.008, hatched): 0,49.66 0,0 71.88,0 71.88,49.68 0,49.68
(copper drawn outside any net)
  shapes: Bottom area x1, Top area x2

### Text on the board
tNames: 3.3v | GND | 5v | GND
bNames: 3.3v